# Altium schematic sheet [02] - BLOCK DIAGRAM.SchDoc
size A2; DocumentNumber: 2; SheetNumber: 2; SheetTotal: 6; PageSetup: Record=PageOptions|CenterHorizontal=True|CenterVertical=True|PrintScale=0.52|XCorrection=1.00|YCorrection=1.00|PrintKind=1|BorderSize=5000000|LeftOffset=0|BottomOffset=0|Orientation=2|PaperLength=1000|PaperWidth=1000|Scale=100|PaperSource=4|PrintQuality=600|MediaType=1|DitherType=10|PrintScaleMode=1|PaperKind=A4|PaperIndex=9
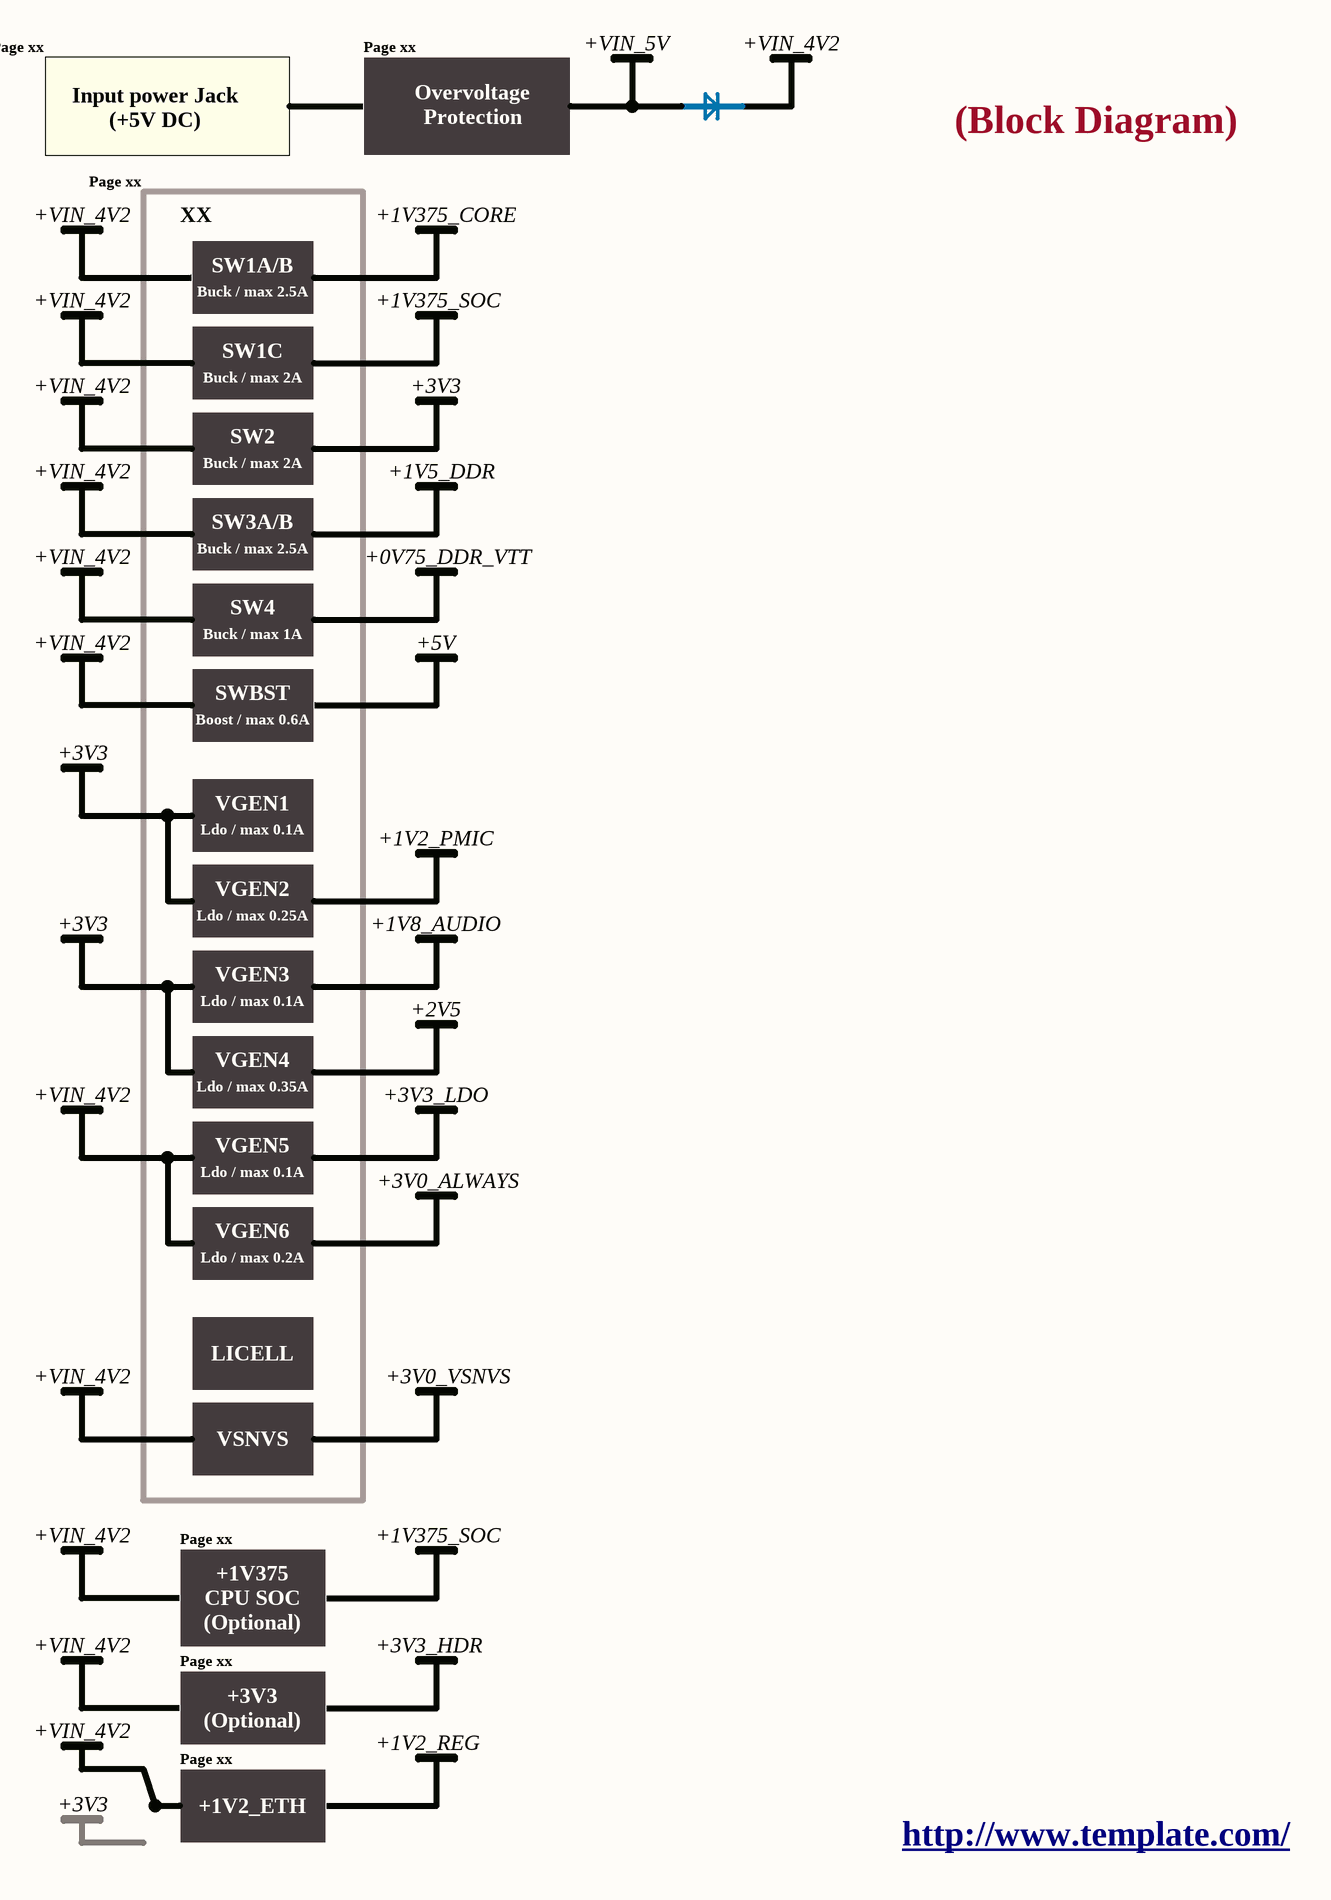
[diagram p0: [02] - BLOCK DIAGRAM.SchDoc, left]
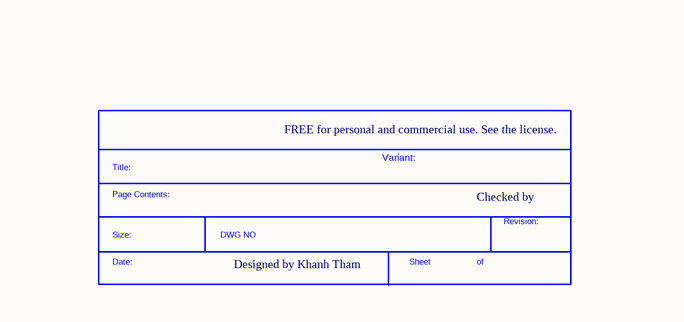
[diagram p1: [02] - BLOCK DIAGRAM.SchDoc, right]

## Parts
*  SDTitleBlock  (value not drawn)  (graphical)

## Notes on the sheet
- Page xx
- Input power Jack
- +VIN_5V
- +VIN_4V2
- (+5V DC)
- Overvoltage
- Protection
- (Block Diagram)
- XX
- SW1A/B
- +1V375_CORE
- Buck / max 2.5A
- +1V375_SOC
- SW1C
- Buck / max 2A
- +3V3
- SW2
- SW3A/B
- +1V5_DDR
- +0V75_DDR_VTT
- SW4
- Buck / max 1A
- SWBST
- +5V
- Boost / max 0.6A
- VGEN1
- Ldo / max 0.1A
- VGEN2
- +1V2_PMIC
- Ldo / max 0.25A
- +1V8_AUDIO
- VGEN3
- VGEN4
- +2V5
- Ldo / max 0.35A
- +3V3_LDO
- VGEN5
- +3V0_ALWAYS
- VGEN6
- Ldo / max 0.2A
- LICELL
- VSNVS
- +3V0_VSNVS
- +1V375
- CPU SOC
- (Optional)
- +3V3_HDR
- FREE for personal and commercial use. See the license.
- +1V2_ETH
- +1V2_REG
- Variant:
- Checked by
- http://www.template.com/
- Designed by Khanh Tham
- (in symbol SDTitleBlock) Title:; Page Contents:; Revision:; Size:; DWG NO; Date:; Sheet; of